# Altium schematic sheet UART.SchDoc
size 220 x 165 mm
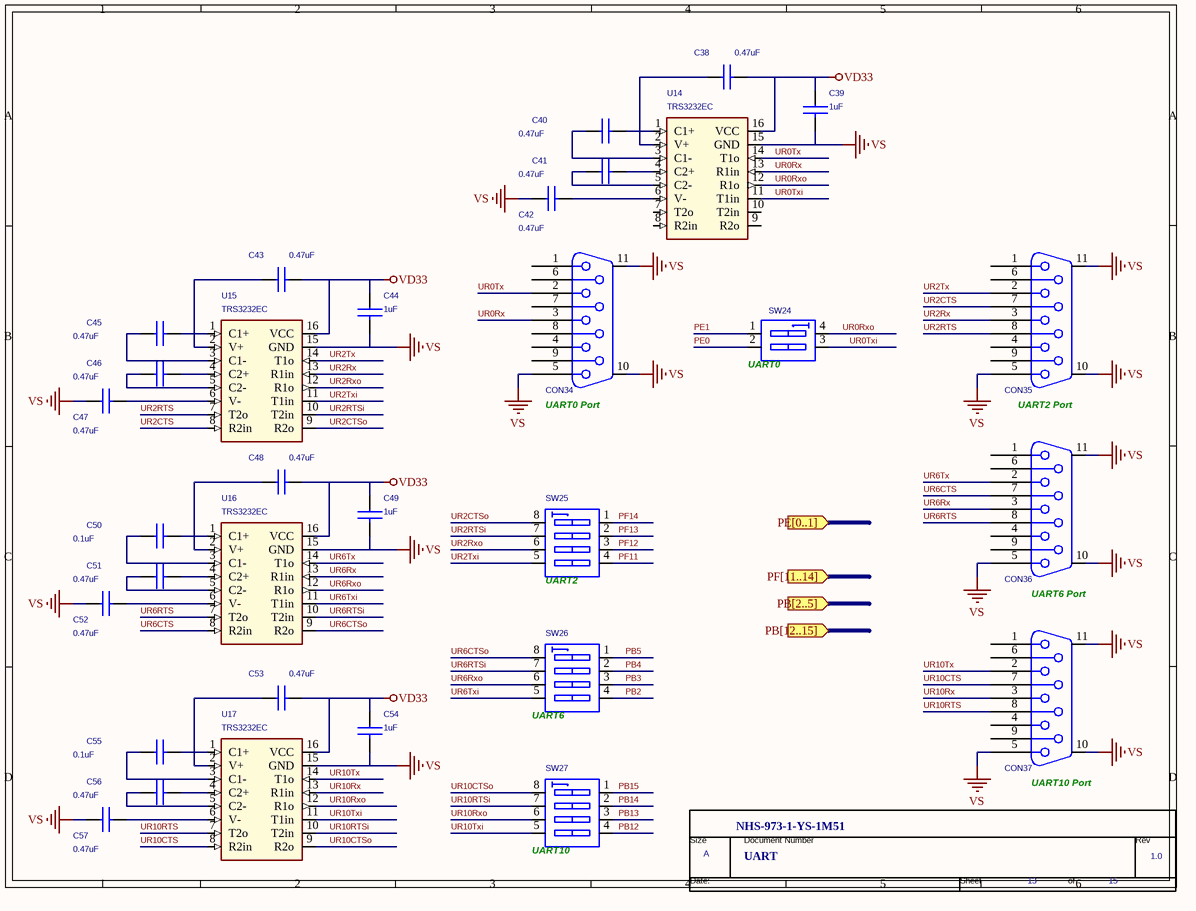
[diagram p0: UART.SchDoc]

## Parts
*  RevCode: 1.0  Page Size: A  Page Number: 13  Page Count: 15  Doc: UART  OrgName: NHS-973-1-YS-1M51  (hidden comment: TitleBlock0N)  (graphical)
C38  0.47uF  [C0603]
C39  1uF  [C0603]
C40  0.47uF  [C0603]
C41  0.47uF  [C0603]
C42  0.47uF  [C0603]
C43  0.47uF  [C0603]
C44  1uF  [C0603]
C45  0.47uF  [C0603]
C46  0.47uF  [C0603]
C47  0.47uF  [C0603]
C48  0.47uF  [C0603]
C49  1uF  [C0603]
C50  0.1uF  [C0603]
C51  0.47uF  [C0603]
C52  0.47uF  [C0603]
C53  0.47uF  [C0603]
C54  1uF  [C0603]
C55  0.1uF  [C0603]
C56  0.47uF  [C0603]
C57  0.47uF  [C0603]
CON34  UART0  [DB9_FMALE]  (value not drawn)
CON35  UART2  [DB9_FMALE]  (value not drawn)
CON36  UART6  [DB9_FMALE]  (value not drawn)
CON37  UART10  [DB9_FMALE]  (value not drawn)
SW24  UART0  [DIPSWx2_2.54mm]  (value not drawn)
SW25  UART2  [SDS-8]  (value not drawn)
SW26  UART3  [SDS-8]  (value not drawn)
SW27  UART4  [SDS-8]  (value not drawn)
U14  TRS3232EC  [SOP16/150]
U15  TRS3232EC  [SOP16/150]
U16  TRS3232EC  [SOP16/150]
U17  TRS3232EC  [SOP16/150]

## Ports
PB[2..5] (in), PB[12..15] (in), PE[0..1] (in), PF[11..14] (in)

## Nets
VD33: C38.2 C39.1 C43.2 C44.1 C48.2 C49.1 C53.2 C54.1 U14.16(VCC) U15.16(VCC) U16.16(VCC) U17.16(VCC)
VS: C39.2 C42.1 C44.2 C47.1 C49.2 C52.1 C54.2 C57.1 CON34.5 CON34.10 CON34.11 CON35.5 CON35.10 CON35.11 CON36.5 CON36.10 CON36.11 CON37.5 CON37.10 CON37.11 U14.15(GND) U15.15(GND) U16.15(GND) U17.15(GND)
PB2: SW26.4(A4)
PB3: SW26.3(A3)
PB4: SW26.2(A2)
PB5: SW26.1(A1)
PB12: SW27.4(A4)
PB13: SW27.3(A3)
PB14: SW27.2(A2)
PB15: SW27.1(A1)
PE0: SW24.2(A2)
PE1: SW24.1(A1)
PF11: SW25.4(A4)
PF12: SW25.3(A3)
PF13: SW25.2(A2)
PF14: SW25.1(A1)
UR0Rx: CON34.3 U14.13(R1in)
UR0Rxo: SW24.4(B1) U14.12(R1o)
UR0Tx: CON34.2 U14.14(T1o)
UR0Txi: SW24.3(B2) U14.11(T1in)
UR2CTS: CON35.7 U15.8(R2in)
UR2CTSo: SW25.8(B1) U15.9(R2o)
UR2RTS: CON35.8 U15.7(T2o)
UR2RTSi: SW25.7(B2) U15.10(T2in)
UR2Rx: CON35.3 U15.13(R1in)
UR2Rxo: SW25.6(B3) U15.12(R1o)
UR2Tx: CON35.2 U15.14(T1o)
UR2Txi: SW25.5(B4) U15.11(T1in)
UR6CTS: CON36.7 U16.8(R2in)
UR6CTSo: SW26.8(B1) U16.9(R2o)
UR6RTS: CON36.8 U16.7(T2o)
UR6RTSi: SW26.7(B2) U16.10(T2in)
UR6Rx: CON36.3 U16.13(R1in)
UR6Rxo: SW26.6(B3) U16.12(R1o)
UR6Tx: CON36.2 U16.14(T1o)
UR6Txi: SW26.5(B4) U16.11(T1in)
UR10CTS: CON37.7 U17.8(R2in)
UR10CTSo: SW27.8(B1) U17.9(R2o)
UR10RTS: CON37.8 U17.7(T2o)
UR10RTSi: SW27.7(B2) U17.10(T2in)
UR10Rx: CON37.3 U17.13(R1in)
UR10Rxo: SW27.6(B3) U17.12(R1o)
UR10Tx: CON37.2 U17.14(T1o)
UR10Txi: SW27.5(B4) U17.11(T1in)
NetC38_1: C38.1 U14.2(V+)
NetC40_1: C40.1 U14.3(C1-)
NetC40_2: C40.2 U14.1(C1+)
NetC41_1: C41.1 U14.5(C2-)
NetC41_2: C41.2 U14.4(C2+)
NetC42_2: C42.2 U14.6(V-)
NetC43_1: C43.1 U15.2(V+)
NetC45_1: C45.1 U15.3(C1-)
NetC45_2: C45.2 U15.1(C1+)
NetC46_1: C46.1 U15.5(C2-)
NetC46_2: C46.2 U15.4(C2+)
NetC47_2: C47.2 U15.6(V-)
NetC48_1: C48.1 U16.2(V+)
NetC50_1: C50.1 U16.3(C1-)
NetC50_2: C50.2 U16.1(C1+)
NetC51_1: C51.1 U16.5(C2-)
NetC51_2: C51.2 U16.4(C2+)
NetC52_2: C52.2 U16.6(V-)
NetC53_1: C53.1 U17.2(V+)
NetC55_1: C55.1 U17.3(C1-)
NetC55_2: C55.2 U17.1(C1+)
NetC56_1: C56.1 U17.5(C2-)
NetC56_2: C56.2 U17.4(C2+)
NetC57_2: C57.2 U17.6(V-)

Not connected (* = marked no-connect by the designer): CON34 1 4 6 7 8 9; CON35 1 4 6 9; CON36 1 4 6 9; CON37 1 4 6 9; U14 7(T2o) 8(R2in) 9(R2o) 10(T2in)

## Notes on the sheet
- (near SW24) UART0
- (near CON34) UART0 Port
- UART2 Port
- (near SW25) UART2
- UART6 Port
- (near SW26) UART6
- (near CON37) UART10 Port
- (near SW27) UART10
- (in symbol TitleBlock0N) Size; Document Number; Rev; Date:; Sheet; of

## Library data of the parts
C38-C57 = CAP NP
CON34-CON37 = CONNECTOR DB9_0
SW24 = SW DIP-2_0
SW25-SW27 = SW DIP-4_0
U14-U17 = ADM232_1
* = TitleBlock0N: Page Create Date: April 25, 1995